# EAGLE design SkateMate_Glove (EAGLE 7.6.0)
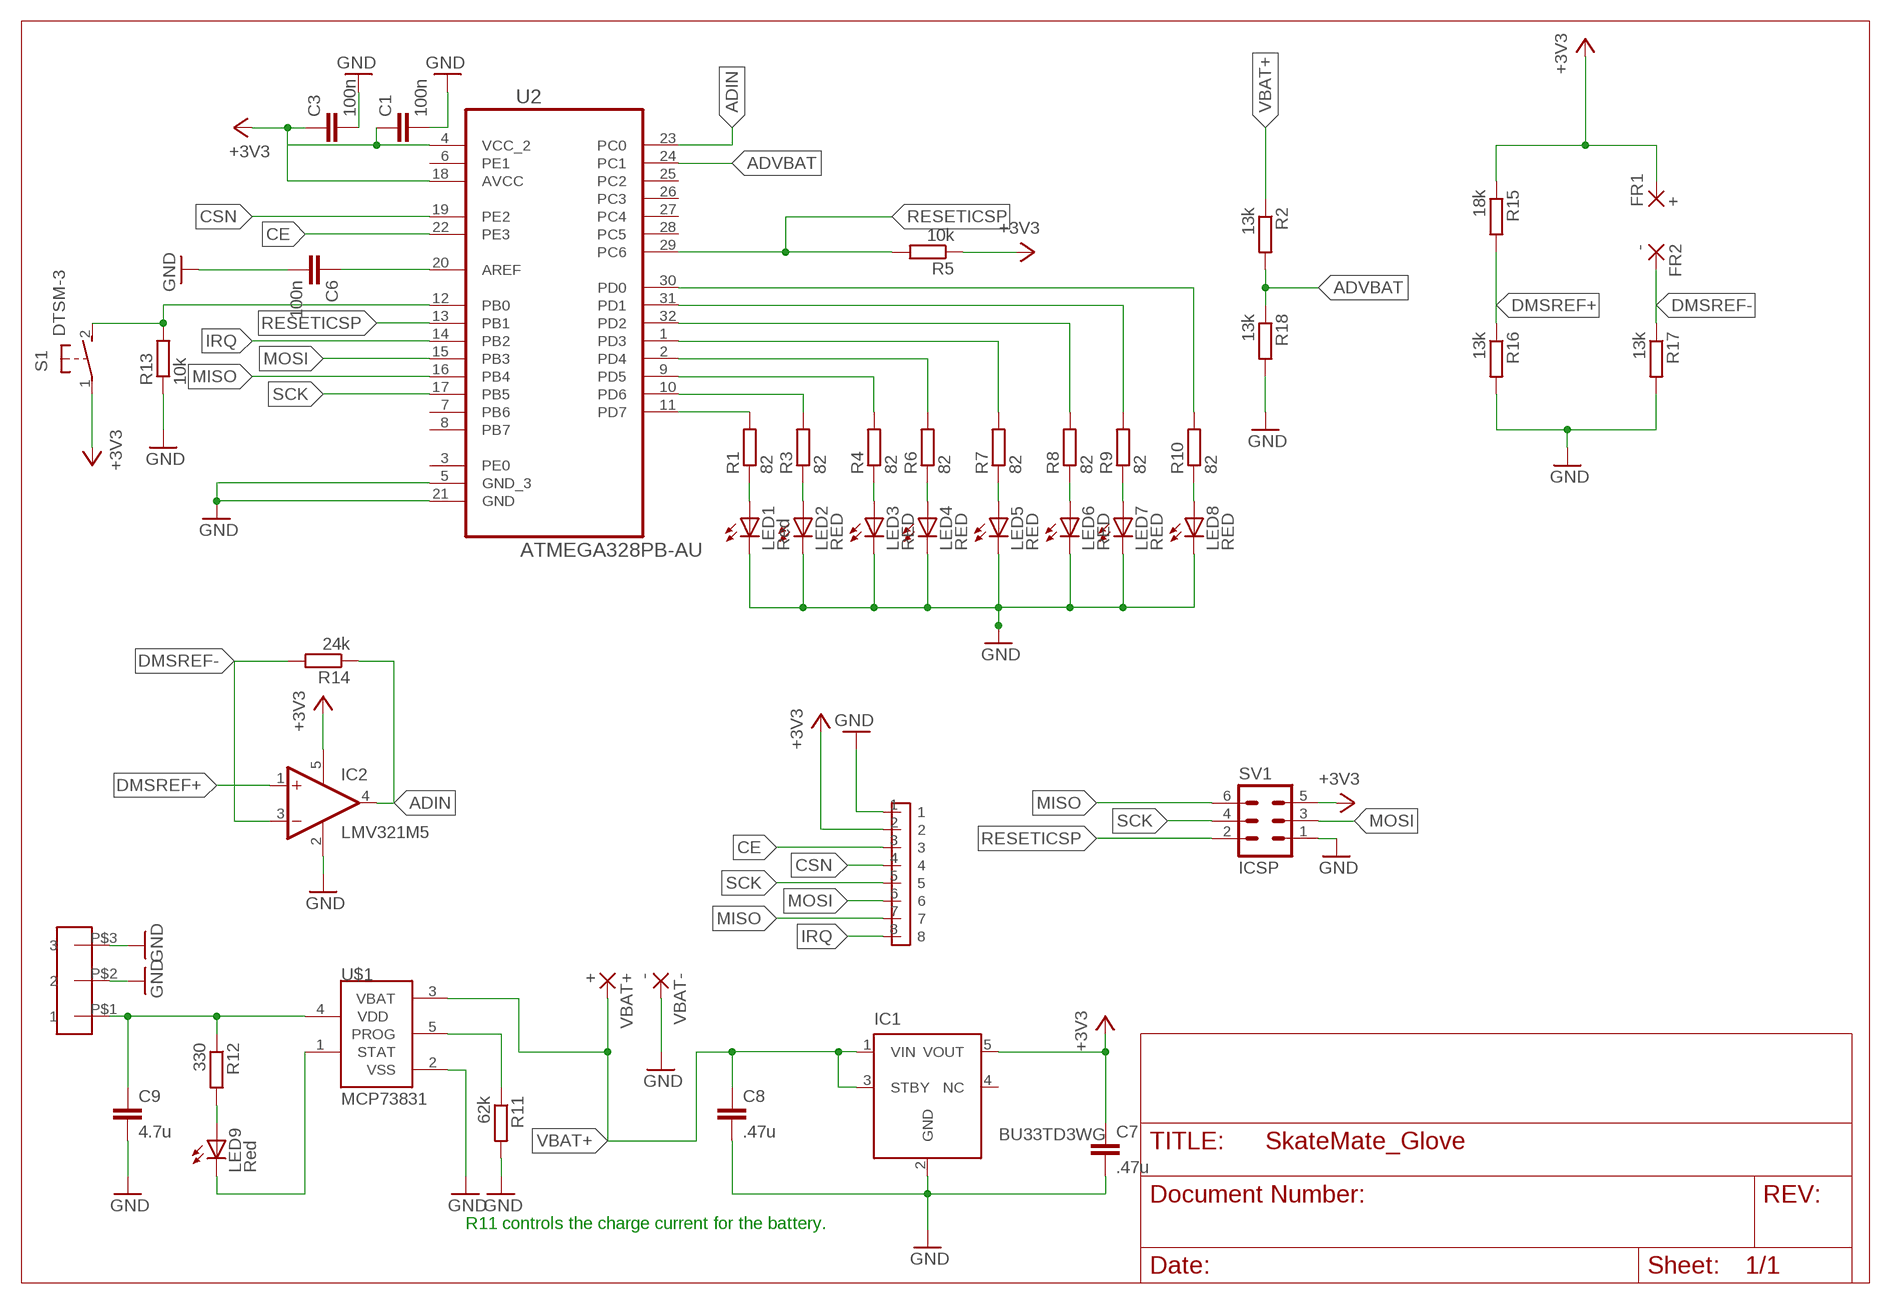
[diagram p0: schematic, sheet 1]

## Parts
C1  100n  CC0603  [C0603]
C3  100n  CC0603  [C0603]
C6  100n  CC0603  [C0603]
C7  .47u  CC0603  [C0603]
C8  .47u  CC0603  [C0603]
C9  4.7u  CC0603  [C0603]
FR1  +  1,6/0,8  [1,6/0,8]
FR2  -  1,6/0,8  [1,6/0,8]
IC1  BU33TD3WG  BU33TD3WG-TR  [SOT23-5]
IC2  LMV321M5  [SOT23-5]
LED1  Red  LEDCHIPLED_0805  [CHIPLED_0805]
LED2  RED  LEDCHIPLED_0805  [CHIPLED_0805]
LED3  RED  LEDCHIPLED_0805  [CHIPLED_0805]
LED4  RED  LEDCHIPLED_0805  [CHIPLED_0805]
LED5  RED  LEDCHIPLED_0805  [CHIPLED_0805]
LED6  RED  LEDCHIPLED_0805  [CHIPLED_0805]
LED7  RED  LEDCHIPLED_0805  [CHIPLED_0805]
LED8  RED  LEDCHIPLED_0805  [CHIPLED_0805]
LED9  Red  LEDCHIPLED_0805  [CHIPLED_0805]
R1  82  RR0603  [R0603]
R2  13k  RR0603  [R0603]
R3  82  RR0603  [R0603]
R4  82  RR0603  [R0603]
R5  10k  RR0603  [R0603]
R6  82  RR0603  [R0603]
R7  82  RR0603  [R0603]
R8  82  RR0603  [R0603]
R9  82  RR0603  [R0603]
R10  82  RR0603  [R0603]
R11  62k  RR0603  [R0603]
R12  330  RR0603  [R0603]
R13  10k  RR0603  [R0603]
R14  24k  RR0603  [R0603]
R15  18k  RR0603  [R0603]
R16  13k  RR0603  [R0603]
R17  13k  RR0603  [R0603]
R18  13k  RR0603  [R0603]
S1  DTSM-3  [DTSM-3]
SV1  ICSP  MA03-2  [MA03-2]
U2  ATMEGA328PB-AU  [QFP80P900X900X120-32N]
U$1  MCP73831  [SOT23-5L]
U$2  HEADER1,27  [HEADER1,27]
U$3  3PINHEADER  [3PINHEADER]
VBAT+  +  1,6/0,8  [1,6/0,8]
VBAT-  -  1,6/0,8  [1,6/0,8]

## Nets
+3V3: C1.1 C3.1 C7.1 FR1.1(P) IC1.5(VOUT) IC2.5(V+) R5.1 R15.1 S1.1 SV1.5 U2.4(VCC_2) U2.18(AVCC) U$2.2
ADIN: IC2.4(OUT) R14.1 U2.23(PC0)
ADVBAT: R2.2 R18.1 U2.24(PC1)
CE: U2.22(PE3) U$2.3
CSN: U2.19(PE2) U$2.4
DMSREF+: IC2.1(+IN) R15.2 R16.1
DMSREF-: FR2.1(P) IC2.3(-IN) R14.2 R17.1
GND: C1.2 C3.2 C6.2 C7.2 C8.2 C9.2 IC1.2(GND) IC2.2(V-) LED1.C LED2.C LED3.C LED4.C LED5.C LED6.C LED7.C LED8.C R11.2 R13.1 R16.2 R17.2 R18.2 SV1.1 U2.5(GND_3) U2.21(GND) U$1.2(VSS) U$2.1 U$3.P$2 U$3.P$3 VBAT-.1(P)
IRQ: U2.14(PB2) U$2.8
MISO: SV1.6 U2.16(PB4) U$2.7
MOSI: SV1.3 U2.15(PB3) U$2.6
N$1: LED1.A R1.1
N$2: LED2.A R3.1
N$3: R13.2 S1.2 U2.12(PB0)
N$4: C6.1 U2.20(AREF)
N$5: R11.1 U$1.5(PROG)
N$6: LED3.A R4.1
N$7: LED6.A R8.1
N$8: LED7.A R9.1
N$9: LED8.A R10.1
N$10: LED4.A R6.1
N$11: LED5.A R7.1
N$12: R1.2 U2.11(PD7)
N$13: R3.2 U2.10(PD6)
N$15: R4.2 U2.9(PD5)
N$16: R6.2 U2.2(PD4)
N$17: R7.2 U2.1(PD3)
N$18: R8.2 U2.32(PD2)
N$19: R9.2 U2.31(PD1)
N$20: R10.2 U2.30(PD0)
N$22: LED9.A R12.2
N$23: LED9.C U$1.1(STAT)
N$24: C9.1 R12.1 U$1.4(VDD) U$3.P$1
RESETICSP: R5.2 SV1.2 U2.13(PB1) U2.29(PC6)
SCK: SV1.4 U2.17(PB5) U$2.5
VBAT+: C8.1 IC1.1(VIN) IC1.3(STBY) R2.1 U$1.3(VBAT) VBAT+.1(P)
Unconnected: IC1.4(NC) U2.3(PE0) U2.6(PE1) U2.7(PB6) U2.8(PB7) U2.25(PC2) U2.26(PC3) U2.27(PC4) U2.28(PC5)

## Notes on the sheet
- R11 controls the charge current for the battery.

## Library data of the parts
C1 C3 C6-C9 = eagle-ltspice:C: CAPACITOR, European symbol; SPICEMODEL: NONE; SPICEPREFIX: C
FR1 FR2 VBAT+ VBAT- = wirepad:1,6/0,8: THROUGH-HOLE PAD
IC1 = BU33TD3WG:BU33TD3WG-TR: VOLTAGE REGULATOR; OC_FARNELL: unknown; OC_NEWARK: unknown
IC2 = linear:LMV321?*: General Purpose, Low Voltage, Rail-to-Rail Output Operational Amplifiers Source: http://www.national.com/mpf/LM/LMV321.html http://www.national.com/dt/lmv_qual.pdf
LED1-LED9 = led:LED: LED OSRAM: - CHIPLED LG R971, LG N971, LY N971, LG Q971, LY Q971, LO R971, LY R971 LH N974, LH R974 LS Q976, LO Q976, LY Q976 LO Q996 - Hyper CHIPLED LW Q18S LB Q993, LB Q99A, LB R99A - SideLED LS A670, LO A670, LY A670, LG A670, LP A670 LB A673, LV A673, LT A673, LW A673 LH A674 LY A675 LS A676, LA A676, LO A676, LY A676, LW A676 LS A679, LY A679, LG A679 - Hyper Micro SIDELED® LS Y876, LA Y876, LO Y876, LY Y876 LT Y87S - SmartLED LW L88C, LW L88S LB L89C, LB L89S, LG L890 LS L89K, LO L89K, LY L89K LS L896, LA L896, LO L896, LY L896 - TOPLED LS T670, LO T670, LY T670, LG T670, LP T670 LSG T670, LSP T670, LSY T670, LOP T670, LYG T670 LG T671, LOG T671, LSG T671 LB T673, LV T673, LT T673, LW T673 LH T674 LS T676, LA T676, LO T676, LY T676, LB T676, LH T676, LSB T676, LW T676 LB T67C, LV T67C, LT T67C, LS T67K, LO T67K, LY T67K, LW E67C LS E67B, LA E67B, LO E67B, LY E67B, LB E67C, LV E67C, LT E67C LW T67C LS T679, LY T679, LG T679 LS T770, LO T770, LY T770, LG T770, LP T770 LB T773, LV T773, LT T773, LW T773 LH T774 LS E675, LA E675, LY E675, LS T675 LS T776, LA T776, LO T776, LY T776, LB T776 LHGB T686 LT T68C, LB T68C - Hyper Mini TOPLED® LB M676 - Mini TOPLED Santana® LG M470 LS M47K, LO M47K, LY M47K Source: http://www.osram.convergy.de LUXEON: - LUMILED® LXK2-PW12-R00, LXK2-PW12-S00, LXK2-PW14-U00, LXK2-PW14-V00 LXK2-PM12-R00, LXK2-PM12-S00, LXK2-PM14-U00 LXK2-PE12-Q00, LXK2-PE12-R00, LXK2-PE12-S00, LXK2-PE14-T00, LXK2-PE14-U00 LXK2-PB12-K00, LXK2-PB12-L00, LXK2-PB12-M00, LXK2-PB14-N00, LXK2-PB14-P00, LXK2-PB14-Q00 LXK2-PR12-L00, LXK2-PR12-M00, LXK2-PR14-Q00, LXK2-PR14-R00 LXK2-PD12-Q00, LXK2-PD12-R00, LXK2-PD12-S00 LXK2-PH12-R00, LXK2-PH12-S00 LXK2-PL12-P00, LXK2-PL12-Q00, LXK2-PL12-R00 Source: www.luxeon.com KINGBRIGHT: KA-3528ASYC Source: www.kingbright.com
R1-R18 = eagle-ltspice:R: RESISTOR, European symbol; SPICEMODEL: NONE; SPICEPREFIX: R
S1 = switch-tact:DTSM-3
SV1 = con-lstb:MA03-2: PIN HEADER; OC_FARNELL: unknown; OC_NEWARK: unknown
U2 = Atmel_By_element14_Batch_1-00:ATMEGA328PB-AU: 8-bit Microcontroller with In-System Programmable Flash; MPN: ATMEGA328P-AU; OC_FARNELL: 1715486; OC_NEWARK: 14R4631; PACKAGE: TQFP-32; SUPPLIER: Atmel
U$1 = MCP73831:MCP73831: Miniature Single-Cell, Fully Integrated Li-Ion, Li-Polymer Charge Management Controllers
U$2 = SkateMateMagicGlove:HEADER1,27
U$3 = SkateMateMagicGlove:3PINHEADER

## Board
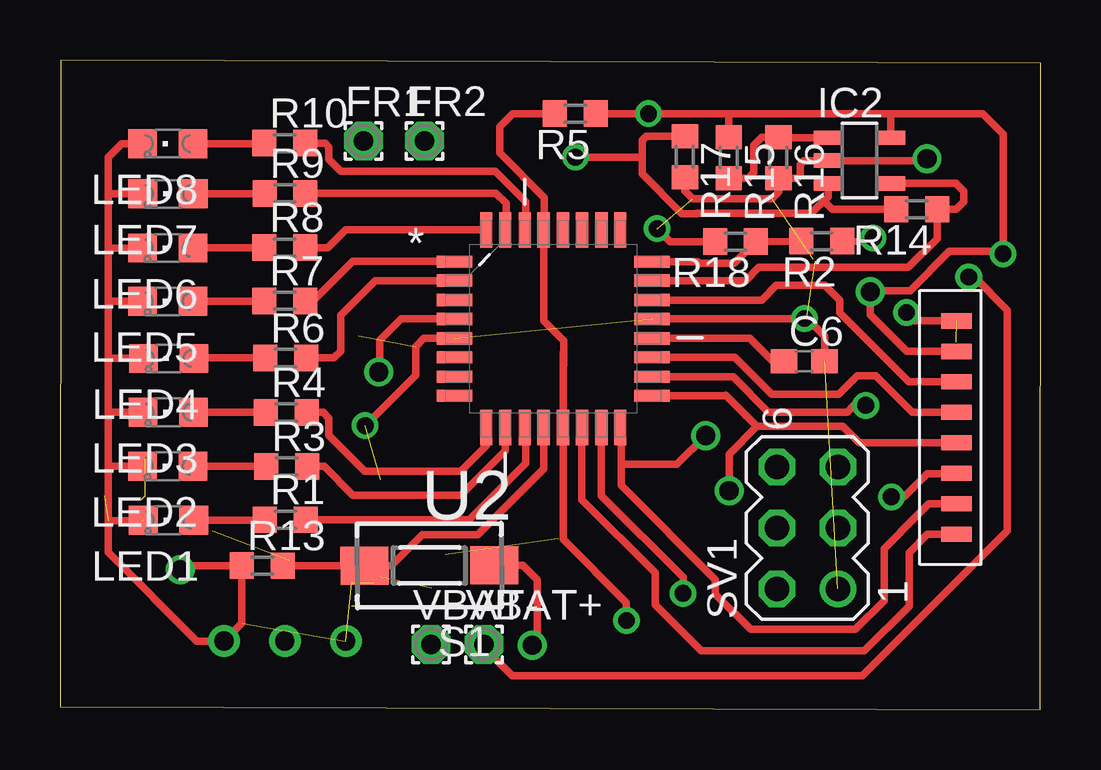
[diagram p1: board, top side]
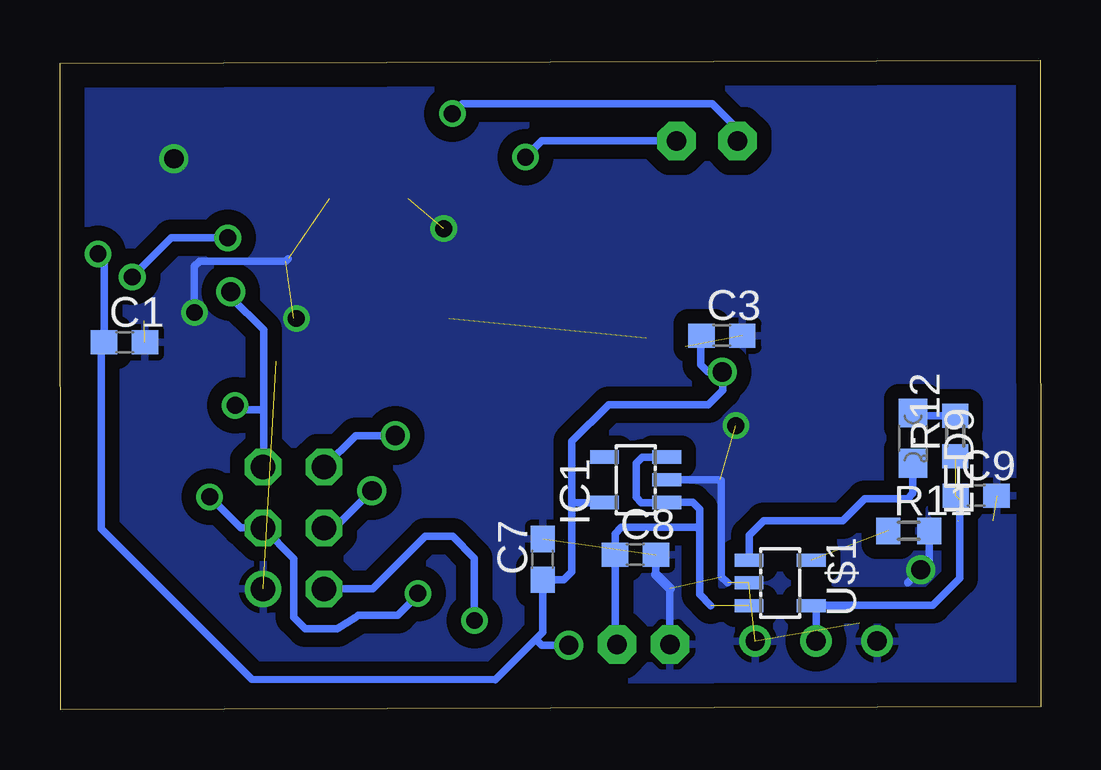
[diagram p2: board, bottom side, seen from below]

Size 40.87 x 27.08 mm. Coordinates in mm from the lower left corner, seen from the top.
Outline: 0,0.14 40.83,0 40.87,26.94 0.04,27.08 0,0.14
Copper layers (1*16): Top 0.035mm / dielectric 1.5mm / Bottom 0.035mm
Design rules "default": minimum track width 10mil, minimum drill 24mil, track to track 8mil, track to pad 8mil, pad to pad 8mil, via to via 8mil, smd to smd 8mil, copper to edge 40mil, drill to drill 8mil, minimum pad ring 10mil, minimum via ring 8mil, stop-mask expansion 4mil, vias tented up to drill 0mil, thermal gap 10mil

### Footprints (pad centres in the part's own frame; a part is rotated, then mirrored left to right if it is on the bottom)
C0603 = smd 1.1 x 1: 1 -0.85,0; 2 0.85,0
1,6/0,8 = drill 0.813 pad 1.6 octagon: 1 0,0
SOT23-5 = smd 0.55 x 1.2: 1 -0.95,-1.3; 2 0,-1.3; 3 0.95,-1.3; 4 0.95,1.3; 5 -0.95,1.3
SOT23-5' = smd 0.6 x 1.2: 1 -0.95,-1.306; 2 0,-1.306; 3 0.95,-1.306; 4 0.95,1.306; 5 -0.95,1.306
CHIPLED_0805 = smd 1.2 x 1.2: A 0,-1.05; C 0,1.05
R0603 = smd 1 x 1.1: 1 -0.85,0; 2 0.85,0
DTSM-3 = smd 2 x 1.6: 1 -2.7,0; 2 2.7,0
MA03-2 = drill 1.016: 1 -2.54,-1.27 | drill 1.016 octagon: 2 -2.54,1.27; 3 0,-1.27; 4 0,1.27; 5 2.54,-1.27; 6 2.54,1.27
QFP80P900X900X120-32N = smd 1.473 x 0.508: 1 -4.115,2.794; 2 -4.115,2.007; 3 -4.115,1.194; 4 -4.115,0.406; 5 -4.115,-0.406; 6 -4.115,-1.194; 7 -4.115,-2.007; 8 -4.115,-2.794; 17 4.115,-2.794; 18 4.115,-2.007; 19 4.115,-1.194; 20 4.115,-0.406; 21 4.115,0.406; 22 4.115,1.194; 23 4.115,2.007; 24 4.115,2.794 | smd 0.508 x 1.473: 9 -2.794,-4.115; 10 -2.007,-4.115; 11 -1.194,-4.115; 12 -0.406,-4.115; 13 0.406,-4.115; 14 1.194,-4.115; 15 2.007,-4.115; 16 2.794,-4.115; 25 2.794,4.115; 26 2.007,4.115; 27 1.194,4.115; 28 0.406,4.115; 29 -0.406,4.115; 30 -1.194,4.115; 31 -2.007,4.115; 32 -2.794,4.115
SOT23-5L = smd 0.533 x 1.2: 1 -0.95,-1.3; 2 0,-1.3; 3 0.95,-1.3 | smd 0.55 x 1.2: 4 0.95,1.3; 5 -0.95,1.3
HEADER1,27 = smd 1.27 x 0.635: 1 -1.016,4.445; 2 -1.016,3.175; 3 -1.016,1.905; 4 -1.016,0.635; 5 -1.016,-0.635; 6 -1.016,-1.905; 7 -1.016,-3.175; 8 -1.016,-4.445
3PINHEADER = drill 0.8: P$1 0,0; P$2 0,2.54; P$3 0,-2.54

### Placement (x,y rotation side)
C1  38.18,15.31 0 bottom
C3  13.29,15.6 0 bottom
C6  31.01,14.52 0 top
C7  20.76,6.27 90 bottom
C8  16.9,6.47 0 bottom
C9  2.7,8.92 0 bottom
FR1  12.65,23.7 0 top
FR2  15.19,23.71 0 top
IC1  16.89,9.59 90 bottom
IC2  LMV321M5  [SOT23-5']  33.31,22.89 270 top
LED1  4.52,7.9 90 top
LED2  4.49,10.15 90 top
LED3  4.51,12.4 90 top
LED4  4.53,14.64 90 top
LED5  4.49,17.02 90 top
LED6  4.49,19.24 90 top
LED7  4.5,21.5 90 top
LED8  4.49,23.59 90 top
LED9  5.33,11.32 180 bottom
R1  9.39,7.92 0 top
R2  31.73,19.53 180 top
R3  9.45,10.14 0 top
R4  9.43,12.39 0 top
R5  21.47,24.84 180 top
R6  9.4,14.66 0 top
R7  9.36,17.04 0 top
R8  9.36,19.26 0 top
R9  9.37,21.52 0 top
R10  9.36,23.61 0 top
R11  5.51,7.46 0 bottom
R12  3.57,11.41 90 bottom
R13  8.43,6.01 359.7 top
R14  35.7,20.86 180 top
R15  27.86,23.01 270 top
R16  29.93,23.01 270 top
R17  26.03,23.05 270 top
R18  28.14,19.51 180 top
S1  15.39,6.02 180.3 top
SV1  31.14,7.58 90 top
U2  20.55,15.88 0 top
U$1  10.87,5.29 270 bottom
U$2  38.37,11.76 0 top
U$3  9.37,2.87 90 top
VBAT+  17.66,2.73 0 top
VBAT-  15.46,2.73 0 top

### Tracks (layer width: path | path; a pad name or v marks a point on that pad's centre or on a via)
+3V3  (via drill 0.7, 0.7 pad 0.81, 0.8 pad 0.61, 0.8 pad 0.81)
  Top 0.305: 22.33,24.85 R5.1 v24.52,24.84 27.86,24.84 | 27.86,24.84 34.69,24.84 | IC2.5 34.62,24.77 34.69,24.84 | S1.1 19.27,6.03 19.88,5.43 19.88,2.9 v19.67,2.69 | 16.43,16.28 U2.4 14.21,16.29 13.32,15.4 13.32,14.12 v13.28,14.08 | U2.18 28.05,13.87 29.51,12.41 32.79,12.41 33.07,12.69 v33.57,12.69 | R15.1 27.86,24.84 | 34.69,24.84 38.45,24.84 39.3,23.99 39.3,19.13 39.29,19.12 v39.29,19 39.19,19.1 37.05,19.1 35.42,17.46 33.81,17.46 v33.76,17.42 33.76,16.46 35.29,14.94 U$2.2
  Bottom 0.305: C7.1 19.88,5.43 19.54,5.76 19.54,8.74 | C7.1 | C7.1 | 19.54,8.74 19.54,11.19 18.02,12.71 13.86,12.71 13.25,13.31 13.25,14.05 v13.28,14.08 13.88,14.08 14.17,14.37 14.17,15.57 C3.1 | IC1.5 19.44,8.64 19.54,8.74 | 20.77,5.41 C7.1 | C7.1 20.76,3.23 21.04,2.94 | 21.04,2.94 22.73,1.25 32.89,1.27 39.16,7.54 39.16,15.31 C1.1 39.03,18.74 v39.29,19 | 32.39,12.51 32.39,15.83 33.76,17.2 v33.76,17.42 | v19.67,2.69 20.79,2.69 21.04,2.94 | FR1.1 12.65,24.21 13.69,25.26 24.1,25.26 v24.52,24.84 | 32.39,12.51 33.39,12.51 v33.57,12.69 | SV1.5 32.39,10.12 32.39,12.51
  Bottom 0.406: 32.39,10.12 SV1.5
ADIN
  Top 0.305: 34.63,21.93 IC2.4 37.33,21.94 37.33,21.93 37.66,21.6 37.66,21.17 37.35,20.86 R14.1 36.55,19.63 35.35,18.43 29.12,18.43 28.59,17.91 | 28.59,17.91 24.71,17.89 | U2.23 28.57,17.89 28.59,17.91
ADVBAT
  Top 0.305: R2.2 R18.1 28.09,18.6 26.65,18.6 26.58,18.67 U2.24
CE
  Top 0.305: U2.22 29.23,17.07 29.84,17.69 31.87,17.69 32.49,17.07 32.49,16.54 35.37,13.67 U$2.3
CSN
  Top 0.305: U2.19 28.11,14.69 29.65,13.14 32.44,13.14 33.22,13.92 33.99,13.92 35.52,12.4 U$2.4
DMSREF+
  Top 0.305: 28.39,22.16 R15.2 28.67,22.16 28.91,22.4 28.91,23.53 29.24,23.86 R16.1 29.96,23.84 IC2.1
DMSREF-  (via drill 0.7)
  Top 0.305: 31.84,21.94 IC2.3 32.01,21.39 31.82,21.21 | R17.1 24.43,23.9 24.26,23.73 24.26,23.1 | 24.26,23.1 24.26,22.33 25.91,20.68 26.53,20.68 30.75,20.68 | v21.47,23.03 24.19,23.03 24.26,23.1 | 30.77,20.66 30.75,20.68 | 30.75,20.68 31.3,20.68 31.82,21.21 | 33.33,20.86 R14.2 32.18,20.86 31.82,21.21
  Bottom 0.305: FR2.1 20.79,23.71 v21.47,23.03
GND  (via drill 0.7, 0.7 pad 0.81, 0.8 pad 0.61, 0.8 pad 0.81)  (15 unrouted)
  Top 0.305: 3.44,7.87 2,7.87 | 4.9,5.73 v5.01,5.84 5.18,6.02 R13.1 7.58,3.62 U$3.P$2 5.7,2.87 2,6.57 2,7.87 | U$2.1 35.62,16.21 v35.27,16.56 | LED8.C 2.56,23.59 2,23.03 2,21.5 | 2,10.03 2,7.87 | 2,12.4 2,14.53 | 2,12.4 2,10.03 | 2,17.02 2,14.53 | 2,19.24 2,17.02 | 2,21.5 2,19.24 | LED2.C 2.12,10.15 2,10.03 | 2,14.53 2.11,14.64 LED4.C | LED3.C 2,12.4 | LED5.C 2,17.02 | LED6.C 2,19.24 | LED7.C 2,21.5 | 24.68,16.3 U2.21 31,16.29 v31.02,16.31 31.12,16.31 31.86,15.57 C6.2 | IC2.2 36.05,22.89 v36.12,22.96 | R16.2 29.94,21.59 29.66,21.3 26.37,21.3 26.03,21.64 R17.2 | R16.2 30.21,22.16 | IC2.2 | R16.2 30.72,22.16 30.84,22.28 30.84,22.72 30.99,22.87 31.99,22.87 IC2.2 | R18.2 25.42,19.51 v24.88,20.05 | U2.5 15.16,15.47 14.81,15.12 14.81,13.94 v12.71,11.84
  Bottom 0.305: R11.2 4.66,6.19 v5.01,5.84 5.56,5.29 | IC1.2 13.37,9.59 13.32,9.54 13.32,5.55 13.06,5.29 | C8.2 16.05,5.64 | 15.46,5.06 VBAT-.1 | v35.27,16.56 35.27,18.47 35.05,18.69 31.47,18.69 31.36,18.8
  Bottom 0.406: 16.05,5.64 15.46,5.06
  pour Bottom (isolate 0.61): -0.19,26.83 40.45,26.62 40.31,0.33 -0.33,0.54
IRQ
  Top 0.305: U$2.8 36.14,7.32 35.38,6.55 35.38,4.32 33.51,2.46 26.72,2.46 24.79,4.39 24.79,5.71 21.75,8.76 U2.14
MISO  (via drill 0.8 pad 0.61)
  Top 0.305: U$2.7 36.2,8.58 35.01,7.39 34.34,6.72 34.34,4.55 33.15,3.35 28.78,3.35 27.3,4.82 27.3,5.43 23.38,9.35 23.38,10.23 | 23.41,10.26 23.38,10.23 | 23.38,10.23 23.38,11.73 U2.16 | 23.38,10.23 25.71,10.23 v26.91,11.43
  Bottom 0.305: 29.71,10.28 SV1.6 28.56,11.43 v26.91,11.43
MOSI  (via drill 0.7 pad 0.81)
  Top 0.305: v34.64,8.88 35.17,8.88 36.14,9.85 37.35,9.85 U$2.6 | 22.6,11.73 U2.15 22.56,8.93 25.96,5.53 v25.96,4.85
  Bottom 0.305: v34.64,8.88 33.34,7.58 SV1.3 31.13,6.3 31.13,3.86 30.66,3.39 29.31,3.39 28.54,3.86 28.46,3.95 26.79,3.95 25.96,4.78 v25.96,4.85
N$1
  Top 0.305: LED1.A 8.52,7.9 R1.1
N$2
  Top 0.305: R3.1 LED2.A
N$3
  Top 0.305: R13.2 S1.2 13.8,6 15.09,7.29 17.4,7.29 20.15,10.04 U2.12
N$4
  Top 0.305: 24.68,15.48 U2.20 28.75,15.47 29.7,14.52 C6.1
N$5  (1 unrouted)
N$6
  Top 0.305: LED3.A 8.57,12.4 R4.1
N$7
  Top 0.305: R8.1 5.56,19.26 LED6.A
N$8
  Top 0.305: LED7.A 8.5,21.5 R9.1
N$9
  Top 0.305: 5.56,23.61 LED8.A 8.49,23.59 R10.1
N$10
  Top 0.305: R6.1 5.6,14.66 LED4.A
N$11
  Top 0.305: LED5.A 8.49,17.02 R7.1
N$12
  Top 0.305: R1.2 17.04,7.92 19.4,10.27 19.4,11.73 U2.11
N$13
  Top 0.305: U2.10 18.55,10.79 16.7,8.95 12.2,8.95 11.01,10.14 R3.2
N$15
  Top 0.305: U2.9 17.76,11.01 16.7,9.95 12.7,9.95 11.2,11.45 11.2,12.15 10.96,12.39 R4.2
N$16
  Top 0.305: 10.38,15.03 10.01,14.66 R6.2 11.41,14.66 11.7,14.95 11.7,16.45 13.14,17.89 U2.2
N$17
  Top 0.305: R7.2 10.56,17.04 12.2,18.68 16.44,18.68 U2.1
N$18
  Top 0.305: R8.2 11.16,19.26 11.9,20 17.75,20 U2.32
N$19
  Top 0.305: R9.2 18.17,21.52 18.59,21.1 18.59,20 18.58,19.99 U2.31
N$20
  Top 0.305: R10.2 11.04,23.61 11.2,23.45 11.2,22.95 11.7,22.45 18.13,22.45 19.4,21.18 19.4,20.03 U2.30
N$22
  Bottom 0.305: R12.2 5.22,12.26 LED9.A
N$23
  Bottom 0.305: U$1.1 12.16,7.29 11.55,7.89 8.25,7.89 7.33,8.8 5.55,8.8 5.34,9.02 5.34,10.26 LED9.C
N$24  (2 unrouted)
  Bottom 0.305: U$3.P$1 9.37,4.14 U$1.4 9.55,4.36 4.51,4.36 3.38,5.49 3.38,8.75 | 3.55,10.54 R12.1
RESETICSP  (via drill 0.7)
  Top 0.305: 20.64,24.81 R5.2 18.86,24.84 18.32,24.3 18.32,23.21 20.18,21.34 | 20.18,21.34 | 20.18,21.34 20.18,20.03 U2.29 20.15,16.22 20.99,15.38 20.99,14.37 20.96,14.34 | 20.96,14.34 U2.13 20.96,7.1 23.6,4.46 v23.6,3.73 | 20.96,14.34 20.96,14.87
  Bottom 0.305: SV1.2 27.85,5.04 25.66,7.23 24.51,7.23 23.6,6.32 v23.6,3.73
SCK  (via drill 0.8 pad 0.61)
  Top 0.305: 27.76,13.09 28.58,12.26 | 27.76,13.09 27.73,13.11 24.71,13.09 | 28.58,12.26 28.57,12.26 | 27.86,9.14 v27.88,9.13 27.88,10.66 29.03,11.81 | 29.03,11.81 28.58,12.26 | 29.03,11.81 32.61,11.81 33.3,11.13 U$2.5 | U2.17 27.76,13.09
  Bottom 0.305: SV1.4 29.43,7.58 v27.88,9.13
VBAT+  (via drill 0.7)  (1 unrouted)
  Top 0.305: VBAT+.1 17.66,2.6 18.84,1.42 33.43,1.42 39.48,7.46 39.48,16.65 38.08,18.04 v37.86,18.04 | R2.1 33.72,19.51 v33.88,19.67
  Bottom 0.305: 14.33,7.6 14.34,7.59 | IC1.1 | 13.75,4.34 14.22,4.81 14.22,5.46 | 14.22,5.46 14.22,5.47 | 14.22,5.46 14.22,7.71 | IC1.1 14.5,8.65 14.22,8.36 14.22,7.71 | IC1.1 16.66,8.64 16.87,8.85 16.87,10.27 16.61,10.53 IC1.3 | 14.33,7.6 17.48,7.6 17.74,7.33 C8.1 17.75,2.81 VBAT+.1 | 14.22,7.71 14.33,7.6 | v33.88,19.67 36.23,19.67 v37.86,18.04